# Altium schematic sheet I2C TH Sensor Socket.SchDoc: I2C TH Sensor Socket
size 292 x 193 mm; SheetNumber: 12; SheetTotal: 21
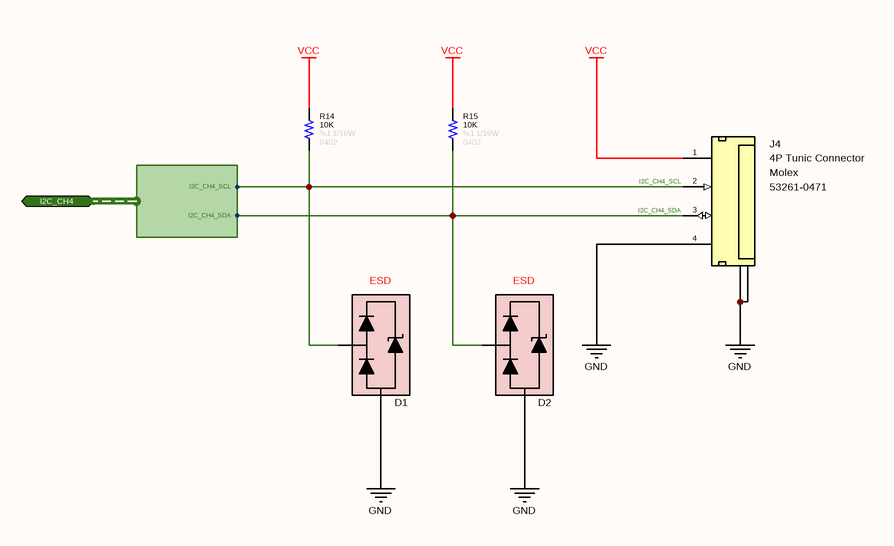
[diagram p0: I2C TH Sensor Socket.SchDoc]

## Parts
D1  0402ESDA-MLP1  [ESD_0402]  (value not drawn)
D2  0402ESDA-MLP1  [ESD_0402]  (value not drawn)
J4  Manufacturer Name: Molex  Manufacturer Part Number: 53261-0471  [Connector_Tunic 4P]  (hidden comment: 4P SMD Tunic Connector)
R14  value 10K  Tolerance: %1  Case: 0402  Power: 1/16W  [RESISTOR_0402]  (hidden comment: 10K - 0402 - %1 - 1/16W)
R15  value 10K  Tolerance: %1  Case: 0402  Power: 1/16W  [RESISTOR_0402]  (hidden comment: 10K - 0402 - %1 - 1/16W)

## Ports
I2C_CH4 (bidir, harness I2C_CH4)

## Harnesses
I2C_CH4: I2C_CH4_SCL, I2C_CH4_SDA

## Nets
GND: D1.2(GND) D2.2(GND) J4.4(Pin-4) J4.5(GND) J4.6(GND)
VCC: J4.1(Pin-1) R14.2 R15.2
I2C_CH4_SCL: D1.1(I/O) J4.2(Pin-2) R14.1 ; port I2C_CH4.I2C_CH4_SCL
I2C_CH4_SDA: D2.1(I/O) J4.3(Pin-3) R15.1 ; port I2C_CH4.I2C_CH4_SDA

## Notes on the sheet
- © 2021 All rights reserved.
  This document may not, in whole or in part, be copied, photocopied, reproduced, translated or converted to any electronic or machine readable from without prior written permission of Mehmet Günce Akkoyun.
  Engineer contact : akkoyun@me.com
- Property of
- Engineer :
- Date :
- Size :
- A4
- Time :
- Project :
- Page :
- /
- Customer :
- Product ID :
- Module ID :
- Version :
- File :
- Revision :
- (in symbol Connector - Mini Tunic 4P (1.25)) 4P Tunic Connector
- (in symbol Diode - TPD1E05U06DPYR) ESD

## Library data of the parts
D1 D2 = Diode - TPD1E05U06DPYR: SUPPRESSOR ESD 30VDC 0402 HFREE; Manufacturer Name: Eaton; Breakdown Voltage: 30V; Capacitance: 0.15pF; Manufacturer Part Number: 0402ESDA-MLP1; Case: 0402
J4 = Connector - Mini Tunic 4P (1.25): Mini Tunic Connector with 4P; Pitch: 1.25mm; Position: 4; ROHS: Yes; ComponentLink1Description: DataSheet; ComponentLink1URL: https://www.mouser.com.tr/datasheet/2/276/0532610471_PCB_HEADERS-170942.pdf; ComponentLink2Description: Mouser; ComponentLink2URL: https://www.mouser.com.tr/ProductDetail/Molex/53261-0471?qs=%2Fha2pyFaduhLhIsk8tywtK7BwWtguBSP4XxyDBTOTfs%3D; Case: SMD
R14 R15 = Resistor - 10K [0402]: Thick Film Resistors - SMD 1/16 W 10 KOhm 1%; Manufacturer Name: Vishay; Manufacturer Part Number: CRCW040210K0FKED; ComponentLink1Description: DataSheet; ComponentLink1URL: https://www.mouser.com.tr/datasheet/2/427/dcrcwe3-1762152.pdf; ComponentLink2Description: Mouser; ComponentLink2URL: https://www.mouser.com.tr/ProductDetail/Vishay-Dale/CRCW040210K0FKED?qs=sGAEpiMZZMu61qfTUdNhG2DpbjADlD3GcalbOv9utCY%3D